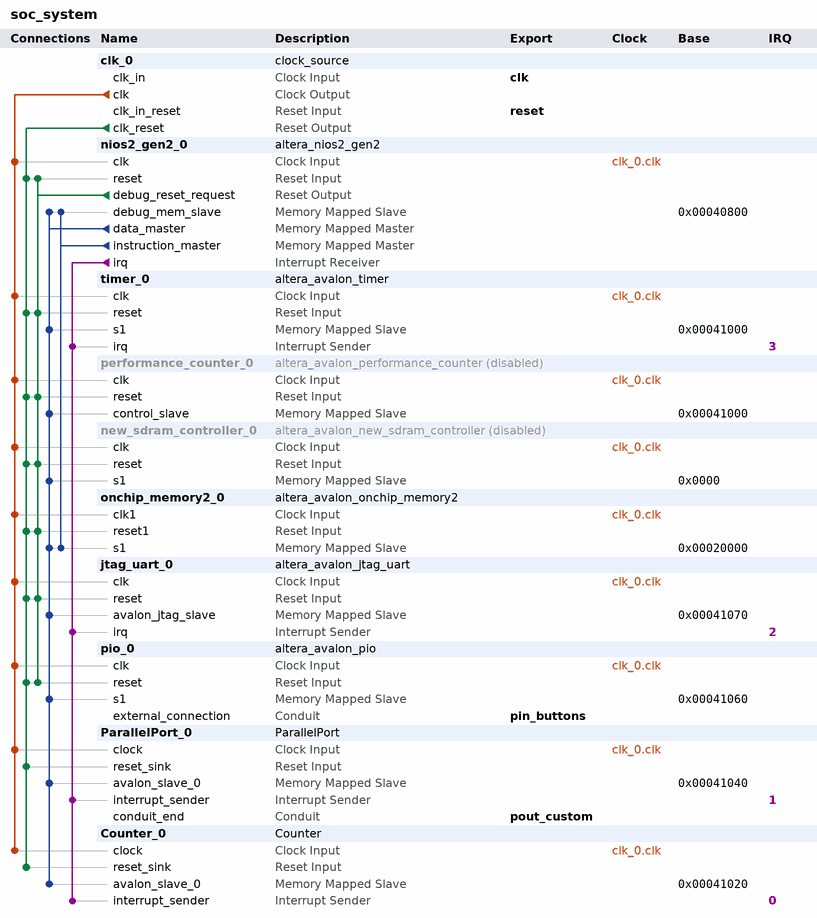
[diagram p0: system contents]
# Platform Designer (Qsys) system soc_system, Cyclone V 5CSEMA5F31C6
# Parameters at their usual value, and those the tool derives, are not listed.
package require -exact qsys 18.1
create_system soc_system
set_project_property DEVICE_FAMILY {Cyclone V}
set_project_property DEVICE 5CSEMA5F31C6

add_instance clk_0 clock_source 18.1
set_instance_parameter_value clk_0 clockFrequency 50000000

add_instance nios2_gen2_0 altera_nios2_gen2 18.1
set_instance_parameter_value nios2_gen2_0 dcache_size 0
set_instance_parameter_value nios2_gen2_0 exceptionSlave onchip_memory2_0.s1
set_instance_parameter_value nios2_gen2_0 icache_size 65536
set_instance_parameter_value nios2_gen2_0 impl Fast
set_instance_parameter_value nios2_gen2_0 resetSlave onchip_memory2_0.s1

add_instance timer_0 altera_avalon_timer 18.1
set_instance_parameter_value timer_0 period 1
set_instance_parameter_value timer_0 periodUnits MSEC

add_instance performance_counter_0 altera_avalon_performance_counter 18.1
set_instance_property performance_counter_0 ENABLED false
set_instance_parameter_value performance_counter_0 numberOfSections 3

add_instance new_sdram_controller_0 altera_avalon_new_sdram_controller 18.1
set_instance_property new_sdram_controller_0 ENABLED false
set_instance_parameter_value new_sdram_controller_0 TAC 5.4
set_instance_parameter_value new_sdram_controller_0 TRCD 15.0
set_instance_parameter_value new_sdram_controller_0 TRP 15.0
set_instance_parameter_value new_sdram_controller_0 casLatency 3
set_instance_parameter_value new_sdram_controller_0 columnWidth 10
set_instance_parameter_value new_sdram_controller_0 dataWidth 16
set_instance_parameter_value new_sdram_controller_0 generateSimulationModel false
set_instance_parameter_value new_sdram_controller_0 model single_Micron_MT48LC4M32B2_7_chip
set_instance_parameter_value new_sdram_controller_0 numberOfBanks 4
set_instance_parameter_value new_sdram_controller_0 numberOfChipSelects 1
set_instance_parameter_value new_sdram_controller_0 powerUpDelay 100.0
set_instance_parameter_value new_sdram_controller_0 refreshPeriod 7.8125
set_instance_parameter_value new_sdram_controller_0 rowWidth 13

add_instance onchip_memory2_0 altera_avalon_onchip_memory2 18.1
set_instance_parameter_value onchip_memory2_0 dataWidth 32
set_instance_parameter_value onchip_memory2_0 dualPort false
set_instance_parameter_value onchip_memory2_0 initMemContent true
set_instance_parameter_value onchip_memory2_0 initializationFileName onchip_mem.hex
set_instance_parameter_value onchip_memory2_0 memorySize 131072

add_instance jtag_uart_0 altera_avalon_jtag_uart 18.1
set_instance_parameter_value jtag_uart_0 simInteractiveOptions NO_INTERACTIVE_WINDOWS

add_instance pio_0 altera_avalon_pio 18.1
set_instance_parameter_value pio_0 direction Input
set_instance_parameter_value pio_0 width 4

add_instance ParallelPort_0 ParallelPort 1.0

add_instance Counter_0 Counter 1.0

# connections
add_connection clk_0.clk Counter_0.clock clock
add_connection clk_0.clk jtag_uart_0.clk clock
add_connection clk_0.clk new_sdram_controller_0.clk clock
add_connection clk_0.clk nios2_gen2_0.clk clock
add_connection clk_0.clk onchip_memory2_0.clk1 clock
add_connection clk_0.clk ParallelPort_0.clock clock
add_connection clk_0.clk performance_counter_0.clk clock
add_connection clk_0.clk pio_0.clk clock
add_connection clk_0.clk timer_0.clk clock
add_connection clk_0.clk_reset Counter_0.reset_sink reset
add_connection clk_0.clk_reset jtag_uart_0.reset reset
add_connection clk_0.clk_reset new_sdram_controller_0.reset reset
add_connection clk_0.clk_reset nios2_gen2_0.reset reset
add_connection clk_0.clk_reset onchip_memory2_0.reset1 reset
add_connection clk_0.clk_reset ParallelPort_0.reset_sink reset
add_connection clk_0.clk_reset performance_counter_0.reset reset
add_connection clk_0.clk_reset pio_0.reset reset
add_connection clk_0.clk_reset timer_0.reset reset
add_connection nios2_gen2_0.debug_reset_request jtag_uart_0.reset reset
add_connection nios2_gen2_0.debug_reset_request new_sdram_controller_0.reset reset
add_connection nios2_gen2_0.debug_reset_request nios2_gen2_0.reset reset
add_connection nios2_gen2_0.debug_reset_request onchip_memory2_0.reset1 reset
add_connection nios2_gen2_0.debug_reset_request performance_counter_0.reset reset
add_connection nios2_gen2_0.debug_reset_request pio_0.reset reset
add_connection nios2_gen2_0.debug_reset_request timer_0.reset reset
add_connection nios2_gen2_0.data_master Counter_0.avalon_slave_0 avalon
set_connection_parameter_value nios2_gen2_0.data_master/Counter_0.avalon_slave_0 baseAddress 0x00041020
add_connection nios2_gen2_0.data_master jtag_uart_0.avalon_jtag_slave avalon
set_connection_parameter_value nios2_gen2_0.data_master/jtag_uart_0.avalon_jtag_slave baseAddress 0x00041070
add_connection nios2_gen2_0.data_master new_sdram_controller_0.s1 avalon
set_connection_parameter_value nios2_gen2_0.data_master/new_sdram_controller_0.s1 baseAddress 0x0000
add_connection nios2_gen2_0.data_master nios2_gen2_0.debug_mem_slave avalon
set_connection_parameter_value nios2_gen2_0.data_master/nios2_gen2_0.debug_mem_slave baseAddress 0x00040800
add_connection nios2_gen2_0.data_master onchip_memory2_0.s1 avalon
set_connection_parameter_value nios2_gen2_0.data_master/onchip_memory2_0.s1 baseAddress 0x00020000
add_connection nios2_gen2_0.data_master ParallelPort_0.avalon_slave_0 avalon
set_connection_parameter_value nios2_gen2_0.data_master/ParallelPort_0.avalon_slave_0 baseAddress 0x00041040
add_connection nios2_gen2_0.data_master performance_counter_0.control_slave avalon
set_connection_parameter_value nios2_gen2_0.data_master/performance_counter_0.control_slave baseAddress 0x00041000
add_connection nios2_gen2_0.data_master pio_0.s1 avalon
set_connection_parameter_value nios2_gen2_0.data_master/pio_0.s1 baseAddress 0x00041060
add_connection nios2_gen2_0.data_master timer_0.s1 avalon
set_connection_parameter_value nios2_gen2_0.data_master/timer_0.s1 baseAddress 0x00041000
add_connection nios2_gen2_0.instruction_master nios2_gen2_0.debug_mem_slave avalon
set_connection_parameter_value nios2_gen2_0.instruction_master/nios2_gen2_0.debug_mem_slave baseAddress 0x00040800
add_connection nios2_gen2_0.instruction_master onchip_memory2_0.s1 avalon
set_connection_parameter_value nios2_gen2_0.instruction_master/onchip_memory2_0.s1 baseAddress 0x00020000
add_connection nios2_gen2_0.irq Counter_0.interrupt_sender interrupt
set_connection_parameter_value nios2_gen2_0.irq/Counter_0.interrupt_sender irqNumber 0
add_connection nios2_gen2_0.irq jtag_uart_0.irq interrupt
set_connection_parameter_value nios2_gen2_0.irq/jtag_uart_0.irq irqNumber 2
add_connection nios2_gen2_0.irq ParallelPort_0.interrupt_sender interrupt
set_connection_parameter_value nios2_gen2_0.irq/ParallelPort_0.interrupt_sender irqNumber 1
add_connection nios2_gen2_0.irq timer_0.irq interrupt
set_connection_parameter_value nios2_gen2_0.irq/timer_0.irq irqNumber 3

# exported interfaces
add_interface clk clock sink
set_interface_property clk EXPORT_OF clk_0.clk_in
add_interface pin_buttons conduit end
set_interface_property pin_buttons EXPORT_OF pio_0.external_connection
add_interface pout_custom conduit end
set_interface_property pout_custom EXPORT_OF ParallelPort_0.conduit_end
add_interface reset reset sink
set_interface_property reset EXPORT_OF clk_0.clk_in_reset

set_interconnect_requirement {$system} qsys_mm.clockCrossingAdapter HANDSHAKE
set_interconnect_requirement {$system} qsys_mm.enableEccProtection FALSE
set_interconnect_requirement {$system} qsys_mm.insertDefaultSlave FALSE
set_interconnect_requirement {$system} qsys_mm.maxAdditionalLatency 1

save_system soc_system.qsys
